# EAGLE design linear_lm358 (EAGLE 6.4)
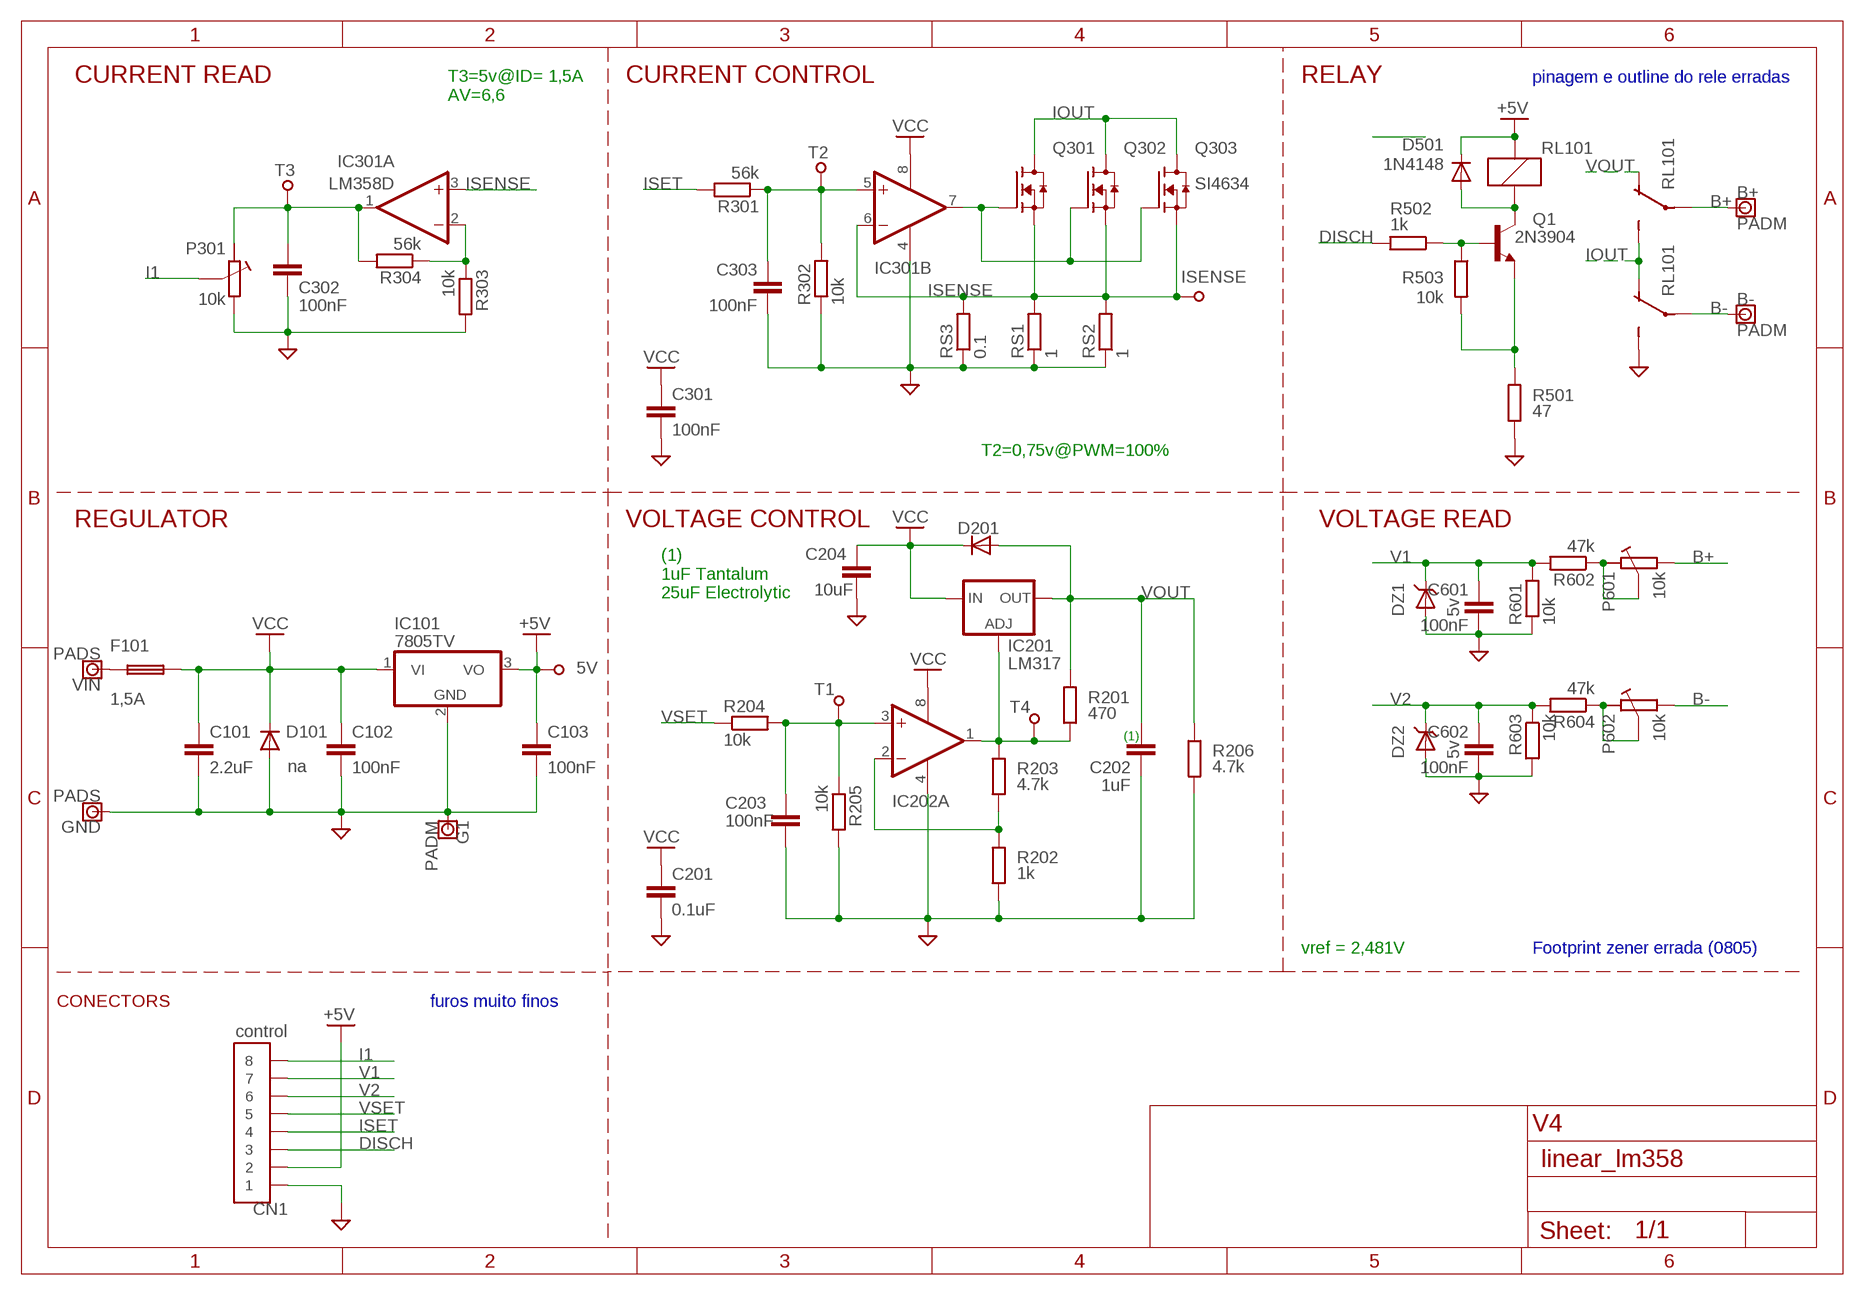
[diagram p0: schematic, sheet 1]

## Parts
5V  TEST_POINT  [TP]
B+  PADM  [PAD_1M]
B-  PADM  [PAD_1M]
C101  2.2uF  C-EUC3225  [C3225]
C102  100nF  C-EUC3225  [C3225]
C103  100nF  C-EUC3225  [C3225]
C201  0.1uF  C-EUC0805K  [C0805K]
C202  1uF  C-EUC1210  [C1210]
C203  100nF  C-EUC0805K  [C0805K]
C204  10uF  C-EUC1210  [C1210]
C301  100nF  C-EUC0805K  [C0805K]
C302  100nF  C-EUC0805K  [C0805K]
C303  100nF  C-EUC0805K  [C0805K]
C601  100nF  C-EUC0805K  [C0805K]
C602  100nF  C-EUC0805K  [C0805K]
CN1  control  CON80.7  [SIL8-0.7]
D101  na  DIODE-DO214BA  [DO214BA]
D201  na  DIODE-DO214BA  [DO214BA]
D501  1N4148  DIODE-DO214BA  [DO214BA]
DZ1  5v  ZENER  [D0805]
DZ2  5v  ZENER  [D0805]
F101  1,5A  FUSESMALLER_PADS  [F1210L]
G1  PADM  [PAD_1M]
GND  PADS  [PAD_01]
IC101  7805TV  [TO220V]
IC201  LM317  LM317TS  [317TS]
IC202  LM358D  [SO08]
IC301  LM358D  [SO08]
ISENSE  TEST_POINT  [TP]
P301  10k  POT  [TRIM_POT]
P601  10k  POT  [TRIM_POT]
P602  10k  POT  [TRIM_POT]
Q1  2N3904  [SOT23]
Q301  AO4468  [SO-8]
Q302  AO4468  [SO-8]
Q303  SI4634  AO4468  [SO-8]
R201  470  R-EU_M0805  [M0805]
R202  1k  R-EU_M0805  [M0805]
R203  4.7k  R-EU_M0805  [M0805]
R204  10k  R-EU_M0805  [M0805]
R205  10k  R-EU_M0805  [M0805]
R206  4.7k  R-EU_M0805  [M0805]
R301  56k  R-EU_M0805  [M0805]
R302  10k  R-EU_M0805  [M0805]
R303  10k  R-EU_M0805  [M0805]
R304  56k  R-EU_M0805  [M0805]
R501  47  R-EU_R0603  [R0603]
R502  1k  R-EU_R0603  [R0603]
R503  10k  R-EU_R0603  [R0603]
R601  10k  R-EU_M0805  [M0805]
R602  47k  R-EU_M0805  [M0805]
R603  10k  R-EU_M0805  [M0805]
R604  47k  R-EU_M0805  [M0805]
RL101  RELAY_351S  [351S]
RS1  1  R-EU_0617/17  [0617/17]
RS2  1  R-EU_0617/17  [0617/17]
RS3  0.1  R-EU_R2512  [R2512]
T1  TEST_POINT  [TP]
T2  TEST_POINT  [TP]
T3  TEST_POINT  [TP]
T4  TEST_POINT  [TP]
VIN  PADS  [PAD_01]

## Nets
+5V: 5V.1 C103.1 CN1.2 D501.C IC101.3(VO) RL101.C1
B+: B+.1(P) P601.3 RL101.P1(2:P)
B-: B-.1(P) P602.3 RL101.P2(3:P)
DISCH: CN1.3 R502.2
GND: C101.2 C102.2 C103.2 C201.2 C202.2 C203.2 C204.2 C301.2 C302.1 C303.1 C601.2 C602.2 CN1.1 D101.A DZ1.A DZ2.A G1.1(P) GND.P IC101.2(GND) IC202.4(P:V-) IC301.4(P:V-) P301.3 R202.2 R205.2 R206.2 R302.1 R303.2 R501.1 R601.1 R603.2 RL101.NO2(3:NO) RS1.1 RS2.1 RS3.1
I1: CN1.8 P301.2
IOUT: Q301.5(D) Q301.6(D) Q301.7(D) Q301.8(D) Q302.5(D) Q302.6(D) Q302.7(D) Q302.8(D) Q303.5(D) Q303.6(D) Q303.7(D) Q303.8(D) RL101.NC2(3:NC) RL101.NO1(2:NO)
ISENSE: IC301.3(A:+IN) IC301.6(B:-IN) ISENSE.1 Q301.1(S) Q301.2(S) Q301.3(S) Q302.1(S) Q302.2(S) Q302.3(S) Q303.1(S) Q303.2(S) Q303.3(S) RS1.2 RS2.2 RS3.2
ISET: CN1.4 R301.2
N$1: IC301.7(B:OUT) Q301.4(G) Q302.4(G) Q303.4(G)
N$2: C303.2 IC301.5(B:+IN) R301.1 R302.2 T2.1
N$3: P601.1 P601.2 R602.1
N$4: IC201.1(ADJ) IC202.1(A:OUT) R201.1 R203.1 T4.1
N$5: Q1.2(E) R501.2 R503.2
N$7: C302.2 IC301.1(A:OUT) P301.1 R304.2 T3.1
N$8: Q1.1(B) R502.1 R503.1
N$9: D501.A Q1.3(C) RL101.C2
N$10: IC301.2(A:-IN) R303.1 R304.1
N$12: IC202.2(A:-IN) R202.1 R203.2
N$15: F101.1 VIN.P
N$16: P602.1 P602.2 R604.1
N$22: C203.1 IC202.3(A:+IN) R204.2 R205.1 T1.1
V1: C601.1 CN1.7 DZ1.K(C) R601.2 R602.2
V2: C602.1 CN1.6 DZ2.K(C) R603.1 R604.2
VCC: C101.1 C102.1 C201.1 C204.1 C301.1 D101.C D201.C F101.2 IC101.1(VI) IC201.3(IN) IC202.8(P:V+) IC301.8(P:V+)
VOUT [High Current]: C202.1 D201.A IC201.2(OUT) R201.2 R206.1 RL101.NC1(2:NC)
VSET: CN1.5 R204.1
Unconnected: IC202.5(B:+IN) IC202.6(B:-IN) IC202.7(B:OUT)

## Notes on the sheet
- CURRENT READ | CURRENT CONTROL | RELAY | pinagem e outline do rele erradas
- T3=5v@ID= 1,5A
  AV=6,6
- T2=0,75v@PWM=100%
- REGULATOR | VOLTAGE CONTROL | VOLTAGE READ
- (1)
  1uF Tantalum
  25uF Electrolytic
- (1)
- vref = 2,481V | Footprint zener errada (0805)
- CONECTORS | furos muito finos
- V4

## Library data of the parts
5V ISENSE T1-T4 = Mylib:TEST_POINT
B+ B- G1 GND VIN = Mylib:PAD
C101-C103 C201-C204 C301-C303 C601 C602 = resistor:C-EU: CAPACITOR, European symbol
CN1 = Mylib:CON8
D101 D201 D501 = diode:DIODE-: DIODE
DZ1 DZ2 = Mylib:ZENER
F101 = Mylib:FUSE
IC101 = linear:78*: Positive VOLTAGE REGULATOR Source: http://cache.national.com/ds/LM/LM78L05.pdf http://www.fairchildsemi.com/ds/LM/LM7805.pdf
IC201 = v-reg:LM317TS: VOLTAGE REGULATOR
IC202 IC301 = linear:LM358: OP AMP also LM158; LM258; LM2904 Source: http://cache.national.com/ds/LM/LM158.pdf
P301 P601 P602 = Mylib:POT
Q1 = Mylib:2N3904
Q301-Q303 = Mylib:AO4468: 30V N-Channel MOSFET
R201-R206 R301-R304 R501-R503 R601-R604 RS1-RS3 = resistor:R-EU_: RESISTOR, European symbol
RL101 = Mylib:RELAY_351S

## Net classes
1 High Current: width 1.27 mm, drill 0.203 mm, clearance 0.203 mm

## Board
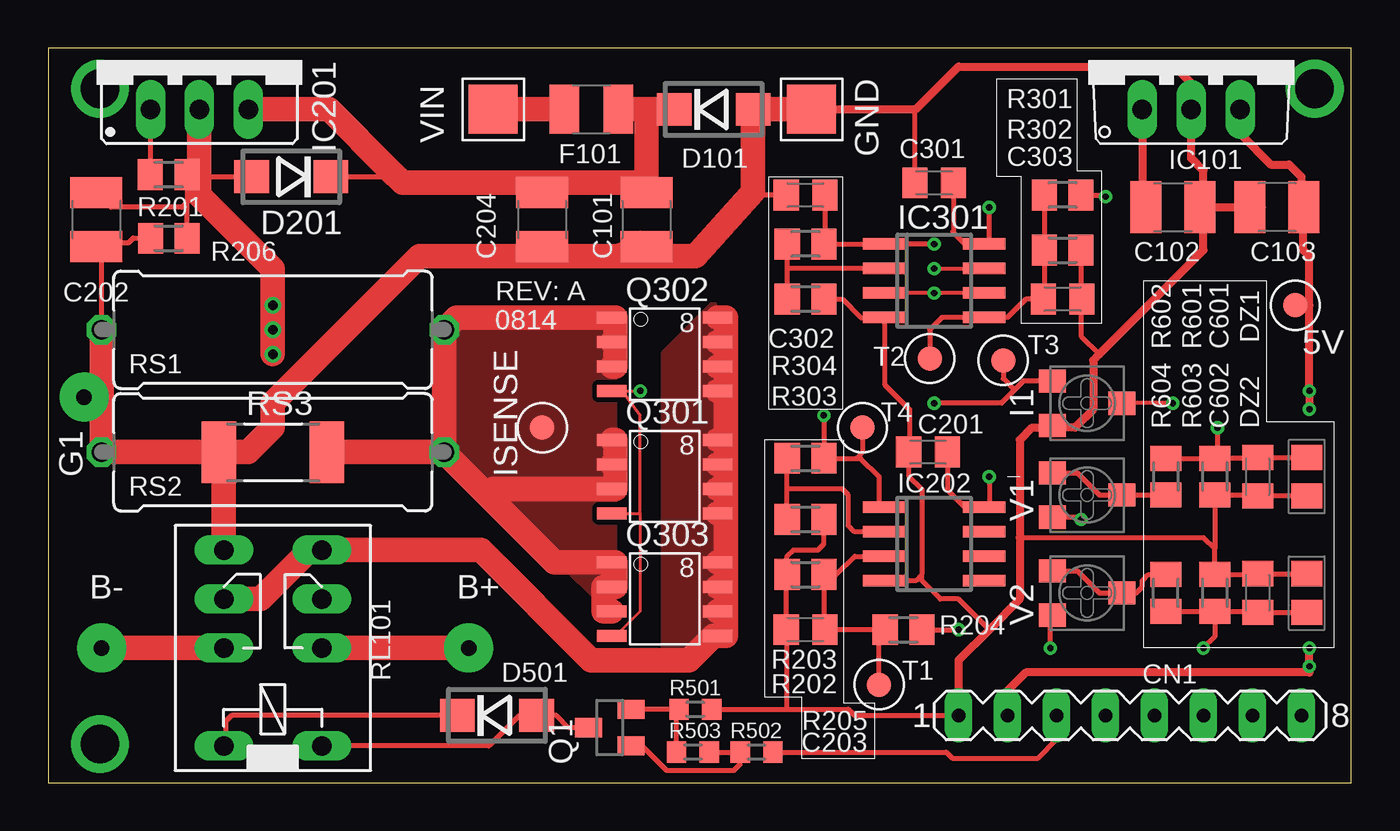
[diagram p1: board, top side]
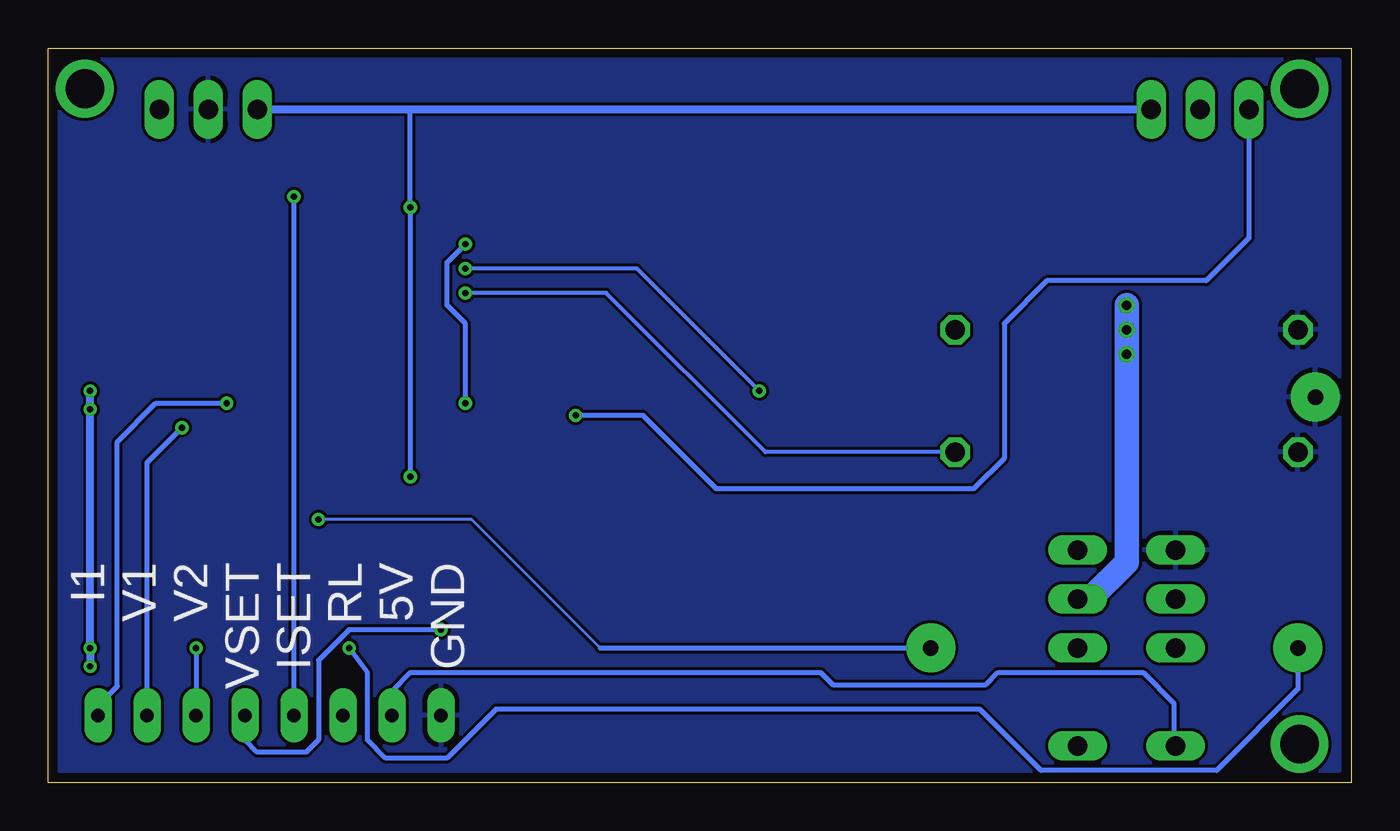
[diagram p2: board, bottom side, seen from below]

Size 67.58 x 38.1 mm. Coordinates in mm from the lower left corner, seen from the top.
Outline: 0,0 67.58,0 67.58,38.1 0,38.1 0,0
Copper layers (1*16): Top 0.0356mm / dielectric 1.5011mm / Bottom 0.0356mm
Design rules "LaenPCBOrder *": minimum track width 6mil, minimum drill 13mil, track to track 6mil, track to pad 6mil, pad to pad 6mil, via to via 6mil, smd to smd 6mil, copper to edge 15mil, drill to drill 13mil, minimum pad ring 7mil, minimum via ring 7mil, stop-mask expansion 3mil, vias tented up to drill 0mil, thermal gap 10mil

### Footprints (pad centres in the part's own frame; a part is rotated, then mirrored left to right if it is on the bottom)
TP = smd 1.27 x 1.27: 1 0,0
PAD_1M = drill 0.8 pad 2.54: 1 0,0
C3225 = smd 1.6 x 2.7: 1 -1.4,0; 2 1.4,0
C0805K = smd 1.3 x 1.6: 1 -1,0; 2 1,0
C1210 = smd 1.6 x 2.7: 1 -1.4,0; 2 1.4,0
SIL8-0.7 = drill 0.7 pad 1.422 long: 1 -8.89,0; 2 -6.35,0; 3 -3.81,0; 4 -1.27,0; 5 1.27,0; 6 3.81,0; 7 6.35,0; 8 8.89,0
DO214BA = smd 1.8 x 1.7: A 2.05,0; C -2.05,0
D0805 = smd 1.3 x 1.6: A 1,0; K -1,0
F1210L = smd 1.524 x 2.54: 1 -1.4,0; 2 1.4,0
PAD_01 = smd 2.54 x 2.54: P 0,0
TO220V = drill 1.016 long: 1 -2.54,-2.54; 2 0,-2.54; 3 2.54,-2.54
317TS = drill 1.016 long: 1 -2.54,-2.54; 2 0,-2.54; 3 2.54,-2.54
SO08 = smd 0.6 x 2.2: 1 -1.905,-2.6; 2 -0.635,-2.6; 3 0.635,-2.6; 4 1.905,-2.6; 5 1.905,2.6; 6 0.635,2.6; 7 -0.635,2.6; 8 -1.905,2.6
TRIM_POT = smd 1.2 x 1.4: 1 -1.15,-1.8; 2 0,1.8; 3 1.15,-1.8
SOT23 = smd 1 x 1.4: 1 -0.95,-1.1; 2 0.95,-1.1; 3 0,1.1
SO-8 = smd 1.524 x 0.61: 1 -2.743,1.905; 2 -2.743,0.635; 3 -2.743,-0.635; 4 -2.743,-1.905; 5 2.743,-1.905; 6 2.743,-0.635; 7 2.743,0.635; 8 2.743,1.905
M0805 = smd 1.3 x 1.6: 1 -0.95,0; 2 0.95,0
R0603 = smd 1 x 1.1: 1 -0.85,0; 2 0.85,0
351S = drill 1.016 long: C1 -3.81,2.54; C2 -3.81,-2.54; NC1 3.81,-2.54; NC2 3.81,2.54; NO1 6.35,-2.54; NO2 6.35,2.54; P1 1.27,-2.54; P2 1.27,2.54
0617/17 = drill 1.016 octagon: 1 -8.89,0; 2 8.89,0
R2512 = smd 1.8 x 3.2: 1 -2.8,0; 2 2.8,0

### Placement (x,y rotation side)
5V  64.67,24.77 180 top
B+  21.81,6.99 0 top
B-  2.76,6.99 0 top
C101  31.02,29.21 270 top
C102  58.33,29.84 0 top
C103  63.72,29.84 180 top
C201  45.62,17.14 180 top
C202  2.49,29.21 270 top
C203  39.27,7.94 180 top
C204  25.62,29.21 270 top
C301  45.94,31.11 180 top
C302  39.27,30.48 0 top
C303  52.61,25.08 180 top
C601  62.72,15.88 270 top
C602  62.72,9.84 90 top
CN1  56.1,3.49 0 top
D101  34.51,34.92 0 top
D201  12.61,31.43 180 top
D501  23.27,3.49 0 top
DZ1  65.26,15.88 270 top
DZ2  65.26,9.84 90 top
F101  28.16,34.92 0 top
G1  1.86,20 0 top
GND  39.59,34.92 180 top
IC101  59.28,37.47 0 top
IC201  7.84,37.47 0 top
IC202  45.94,12.38 270 top
IC301  45.94,26.04 270 top
ISENSE  25.62,18.41 90 top
P301  53.88,19.68 270 top
P601  53.88,14.92 270 top
P602  53.88,9.84 270 top
Q1  29.11,2.86 90 top
Q301  31.97,15.88 0 top
Q302  31.97,22.23 0 top
Q303  31.97,9.53 0 top
R201  6.25,31.54 0 top
R202  39.27,13.65 0 top
R203  39.27,16.83 180 top
R204  44.35,7.94 180 top
R205  39.27,10.79 180 top
R206  6.26,28.24 180 top
R301  52.61,30.48 0 top
R302  52.61,27.62 180 top
R303  39.27,25.08 0 top
R304  39.27,27.94 0 top
R501  33.56,3.81 180 top
R502  36.73,1.59 0 top
R503  33.43,1.59 180 top
R601  60.5,15.88 90 top
R602  57.96,15.88 90 top
R603  60.5,9.84 90 top
R604  57.96,9.84 270 top
RL101  11.65,5.71 90 top
RS1  11.65,23.5 0 top
RS2  11.65,17.14 0 top
RS3  11.65,17.14 0 top
T1  43.09,5.08 180 top
T2  45.72,22 180 top
T3  49.53,21.91 0 top
T4  42.23,18.41 0 top
VIN  23.08,34.92 180 top

### Tracks (layer width: path | path; a pad name or v marks a point on that pad's centre or on a via)
+5V  (via drill 0.33)
  Top 0.254: 65.09,29.81 C103.1 | 5V.1 65.41,24.77 | D501.C 9.53,3.49 9.21,3.17 9.21,2 RL101.C1
  Top 0.406: C103.1 64.99,29.98 64.99,31.43 64.36,32.07 63.41,32.07 61.82,33.66 IC101.3 | CN1.2 49.75,4.76 50.7,5.71 65.41,5.71 v65.41,6.03 v65.41,6.99 | 65.09,29.81 65.09,27.62 65.41,27.3 65.41,24.77 v65.41,20.32 v65.41,19.37
  Bottom 0.254: CN1.2 49.75,4.76 48.8,5.71 27.53,5.71 26.89,5.08 18.95,5.08 18.32,5.71 10.79,5.71 9.21,4.13 9.21,2 RL101.C1
  Bottom 0.406: v65.41,20.32 v65.41,6.99 v65.41,6.03
B+  (via drill 0.33)
  Top 0.254: P601.3 53.44,13.77 v53.56,13.65
  Top 1.27: RL101.P1 B+.1
  Bottom 0.152: v53.56,13.65 45.62,13.65 38.96,6.99
  Bottom 0.254: 38.96,6.99 B+.1
B-  (via drill 0.33)
  Top 0.254: v51.98,6.99 51.98,8.59 P602.3
  Top 1.27: RL101.P2 B-.1
  Bottom 0.254: v51.98,6.99 51.02,5.71 51.02,2.22 50.07,1.27 46.9,1.27 44.35,3.81 19.27,3.81 16.1,0.64 6.99,0.64 2.76,4.86 B-.1
DISCH
  Top 0.254: R502.2 46.58,1.59 46.9,1.27 51.34,1.27 52.29,2.22 CN1.3
GND
  Top 0.152: 30.7,28.57 C101.2 | 9.11,17.14 RS3.1 | 52.61,19.05 P301.3 | 60.55,29.84 C102.2 | 63.09,29.84 C103.2
  Top 0.203: C204.2 25.62,27.3 | G1.1 2.76,20 | 38.96,34.29 GND.P | P301.3 51.46,18.54
  Top 0.254: R302.1 53.56,25.13 C303.1 53.56,24.81 53.56,23.18 54.52,22.23 | C302.1 36.71,30.48 36.56,30.62 | R303.2 41.18,25.08 42.13,24.13 IC301.4 43.4,24.07 43.4,20.64 44.67,19.37 44.67,16.88 C201.2 44.62,15.92 45.31,15.24 45.31,10.79 | C301.2 44.94,34.88 44.99,34.92 | 38.32,10.47 R205.2 | R205.2 38.27,10.74 C203.2 38.32,7.89 38.32,3.81 | R205.2 38.33,11.75 38.64,12.06 39.91,12.06 40.23,12.38 R202.2 | 45.31,10.79 44.99,10.48 IC202.4 | 45.31,10.79 45.31,10.48 46.26,9.53 47.21,9.53 48.8,7.94 | R501.1 38.32,3.81 | 38.32,3.81 41.5,3.81 41.81,3.49 CN1.1 | 60.5,12.11 R603.2 62.67,10.79 C602.2 62.77,10.79 65.21,10.79 DZ2.A | 60.5,12.11 59.91,12.7 50.39,12.7 | 60.5,12.11 R601.1 62.67,14.93 C601.2 DZ1.A | RS1.1 2.76,27.54 C202.2 2.68,28 4.14,28 4.4,28.26 5.29,28.26 R206.2
  Top 0.406: GND.P 44.99,34.92 47.21,37.15 58.42,37.15 59.37,36.2 59.37,35.02 IC101.2 59.28,32.38 59.91,31.75 59.91,30.03 C102.2 | C102.2 C103.2 | C102.2 59.91,29.66 59.91,27.62 54.52,22.23 54.2,21.91 54.2,19.37 53.24,18.41 52.2,18.41 P301.3 51.96,18.41 51.02,18.41 50.39,17.78 50.39,12.7 50.39,9.53 48.8,7.94 47.21,6.35 CN1.1
  Top 1.27: RS3.1 RS2.1 2.76,20 RS1.1 | RL101.NO2 9.11,17.14 10.38,17.14 11.65,18.41 11.65,19.68 19.27,27.3 25.62,27.3 29.56,27.3 | GND.P D101.A 36.56,30.62 33.56,27.3 29.56,27.3 | 29.56,27.3 C101.2
  pour Bottom: 0.64,37.47 66.99,37.47 66.99,0.64 0.64,0.64
I1  (via drill 0.33)
  Top 0.203: v58.33,19.68 P301.2
  Bottom 0.254: v58.33,19.68 62,19.68 64,17.68 64,5 64.99,4.01 CN1.8
IOUT
  Top 1.27: RL101.NC2 11.02,9.53 13.56,12.06 RL101.NO1 22.45,12.06 28.16,6.35 33.24,6.35 34.51,7.62 Q303.5 35.15,7.62 35.15,8.89 | 35.15,21.59 35.15,20.32 | 35.15,22.86 35.15,24.13 Q302.8 | 35.15,22.86 35.15,21.59 | 35.15,21.59 Q302.6 | 35.15,22.86 Q302.7 | 35.15,11.43 35.15,10.16 | 35.15,10.16 35.15,8.89 | 35.15,8.89 Q303.6 | 35.15,10.16 Q303.7 | 35.15,15.24 35.15,13.97 | 35.15,17.78 35.15,16.51 | 35.15,16.51 35.15,15.24 | 35.15,15.24 Q301.6 | 35.15,16.51 Q301.7 | 35.15,13.97 35.15,11.43 | 35.15,11.43 Q303.8 | 35.15,13.97 Q301.5 | 35.15,17.78 35.15,20.32 | 35.15,20.32 Q302.5 | 35.15,17.78 Q301.8
  pour Top (no thermals): 34.51,24.77 31.97,22.23 31.97,6.99 33.24,6.99 34.51,8.26
ISENSE  (via drill 0.33)
  Top 0.203: IC301.6 v45.94,25.4 IC301.3
  Top 1.27: 29.43,22.86 29.43,21.59 Q302.3 | 29.43,22.86 29.43,24.13 Q302.1 21.18,24.13 RS1.2 RS2.2 | 29.43,22.86 Q302.2 | 29.43,16.51 29.43,15.24 Q301.3 23.08,15.24 22.77,14.92 | 29.43,16.51 29.43,17.78 Q301.1 | 29.43,16.51 Q301.2 | Q303.3 28.8,8.89 28.8,10.16 Q303.2 29.43,10.16 29.43,11.43 Q303.1 26.26,11.43 22.77,14.92 | RS2.2 22.77,14.92 | RS2.2 RS3.2
  Bottom 0.203: RS2.2 30.39,17.14 38.64,25.4 v45.94,25.4
  pour Top (isolate 0.254, no thermals): 20.54,17.14 29.43,8.57 29.43,23.5 20.54,23.5
ISET  (via drill 0.33)
  Top 0.254: R301.2 54.75,30.48 v54.83,30.4
  Bottom 0.254: CN1.4 v54.83,30.4
N$1  (via drill 0.33)
  Top 0.152: 30.7,13.97 30.7,8.89 29.43,7.62 Q303.4 | Q301.4 30.7,13.97 | 29.75,20.32 30.7,19.05 30.7,13.97 | 29.75,20.32 Q302.4 | 29.75,20.32 v30.7,20.32
  Top 0.203: v45.94,26.67 IC301.7
  Bottom 0.203: v30.7,20.32 37.05,26.67 v45.94,26.67
N$2
  Top 0.254: R301.1 R302.2 51.66,25.13 C303.2 | 51.66,25.04 C303.2 | C303.2 50.7,25.08 49.75,24.13 IC301.5 46.35,24.13 45.72,23.5 T2.1
N$3
  Top 0.254: P601.1 53.37,16.07 54.52,14.92 P601.2 R602.1
N$4  (via drill 0.33)
  Top 0.254: 41.91,16.83 R203.1 v40.23,19.05 | 41.91,16.83 42.13,16.83 43.09,15.88 43.09,14.35 IC202.1 | R201.1 5.16,31.86 5.3,32 IC201.1 | T4.1 42.23,17.14 41.91,16.83
  Bottom 0.254: IC201.1 5.3,28.26 7.53,26.04 15.78,26.04 18,23.81 18,16.83 19.59,15.24 32.92,15.24 36.73,19.05 v40.23,19.05
N$5
  Top 0.254: Q1.2 R501.2 32.58,3.68 R503.2
N$6  (via drill 2)
  other vias: 2.68,2
N$7  (via drill 0.33)
  Top 0.254: C302.2 40.27,28.31 R304.2 IC301.1 v45.94,27.94 | P301.1 50.59,20.84 50.12,20.37 | 50.12,20.37 49.44,19.68 v45.94,19.68 | T3.1 49.53,20.95 50.12,20.37
  Bottom 0.254: v45.94,19.68 45.94,23.81 46.9,24.77 46.9,26.99 v45.94,27.94
N$8
  Top 0.254: Q1.1 30.8,1.91 32.07,0.64 35.56,0.64 35.88,0.95 R502.1 R503.1
N$9
  Top 0.254: Q1.3 26.99,2.86 26.35,3.49 D501.A 24.45,3.49 22.86,1.91 RL101.C2
N$10
  Top 0.254: R304.1 38.33,26.67 | 38.33,26.67 R303.1 | IC301.2 38.33,26.67
N$11  (via drill 2)
  other vias: 2.68,36
N$12
  Top 0.254: R202.1 38.33,15.24 | 38.33,15.24 R203.2 | IC202.2 41.81,13.02 41.5,13.34 41.5,14.92 41.18,15.24 38.33,15.24
N$13  (via drill 2)
  other vias: 65.68,36
N$15
  Top 1.27: F101.1 VIN.P
N$16
  Top 0.254: P602.1 53.37,10.99 54.52,9.84 P602.2 56.42,9.84 56.74,10.16 56.74,10.48 57.05,10.79 R604.1
N$22
  Top 0.254: IC202.3 41.81,11.75 40.86,10.79 R205.1 40.23,7.99 C203.1 R204.2 43.09,7.62 T1.1
V1  (via drill 0.33)
  Top 0.254: R602.2 R601.2 | R601.2 62.67,16.82 C601.1 DZ1.K | v60.64,18.41 60.64,16.97 R601.2
  Bottom 0.254: CN1.7 62.45,16.61 v60.64,18.41
V2  (via drill 0.33)
  Top 0.254: R604.2 R603.1 | 65.21,8.89 DZ2.K C602.1 62.67,8.89 R603.1 | R603.1 60.5,7.57 v59.91,6.99
  Bottom 0.254: v59.91,6.99 CN1.6
VCC  (via drill 0.33)
  Top 0.203: 48.48,27.94 IC301.8 | C204.1 25.62,31.11 | 57.56,30.16 C102.1
  Top 0.254: C301.1 46.94,28.53 | 46.94,28.53 47.53,27.94 IC301.8 48.8,27.94 v48.8,29.84 | 46.94,28.53 46.9,28.57 | v48.8,15.88 48.8,14.54 IC202.8 47.53,14.29 46.62,15.19 C201.1 | D201.C 17.41,31.43 17.73,31.75
  Top 0.406: IC101.1 56.74,30.03 C102.1
  Top 1.27: F101.2 31.02,34.92 | 31.02,34.92 D101.C | 31.02,34.92 C101.1 30.39,31.11 25.62,31.11 18.37,31.11 17.73,31.75 14.56,34.92 IC201.3
  Bottom 0.254: v48.8,15.88 v48.8,29.84 48.8,34.81 48.68,34.92
  Bottom 0.406: IC101.1 48.68,34.92 IC201.3
VOUT  (via drill 0.51)
  Top 0.254: D201.A 8.21,31.43 7.89,31.75 7.84,31.75 7.63,31.54 R201.2 7.21,30.11 | R206.1 7.21,30.11 | 7.21,30.11 6.94,29.84 3.26,29.84 C202.1
  Top 1.27: v11.65,22.23 v11.65,24.77 11.65,26.67 7.84,30.48 7.84,31.75 IC201.2
  Bottom 1.27: RL101.NC1 13.56,9.53 11.65,11.43 v11.65,22.23 v11.65,23.5 v11.65,24.77
VSET  (via drill 0.33)
  Top 0.254: R204.1 v47.21,7.94
  Bottom 0.254: v47.21,7.94 51.98,7.94 53.56,6.35 53.56,2.22 54.2,1.59 56.74,1.59 57.37,2.22 CN1.5

### Text on the board
tPlace: REV: A / 0814
tNames: I1 | V1 | V2
bNames: I1 / V1 / V2 / VSET / ISET / RL / 5V / GND